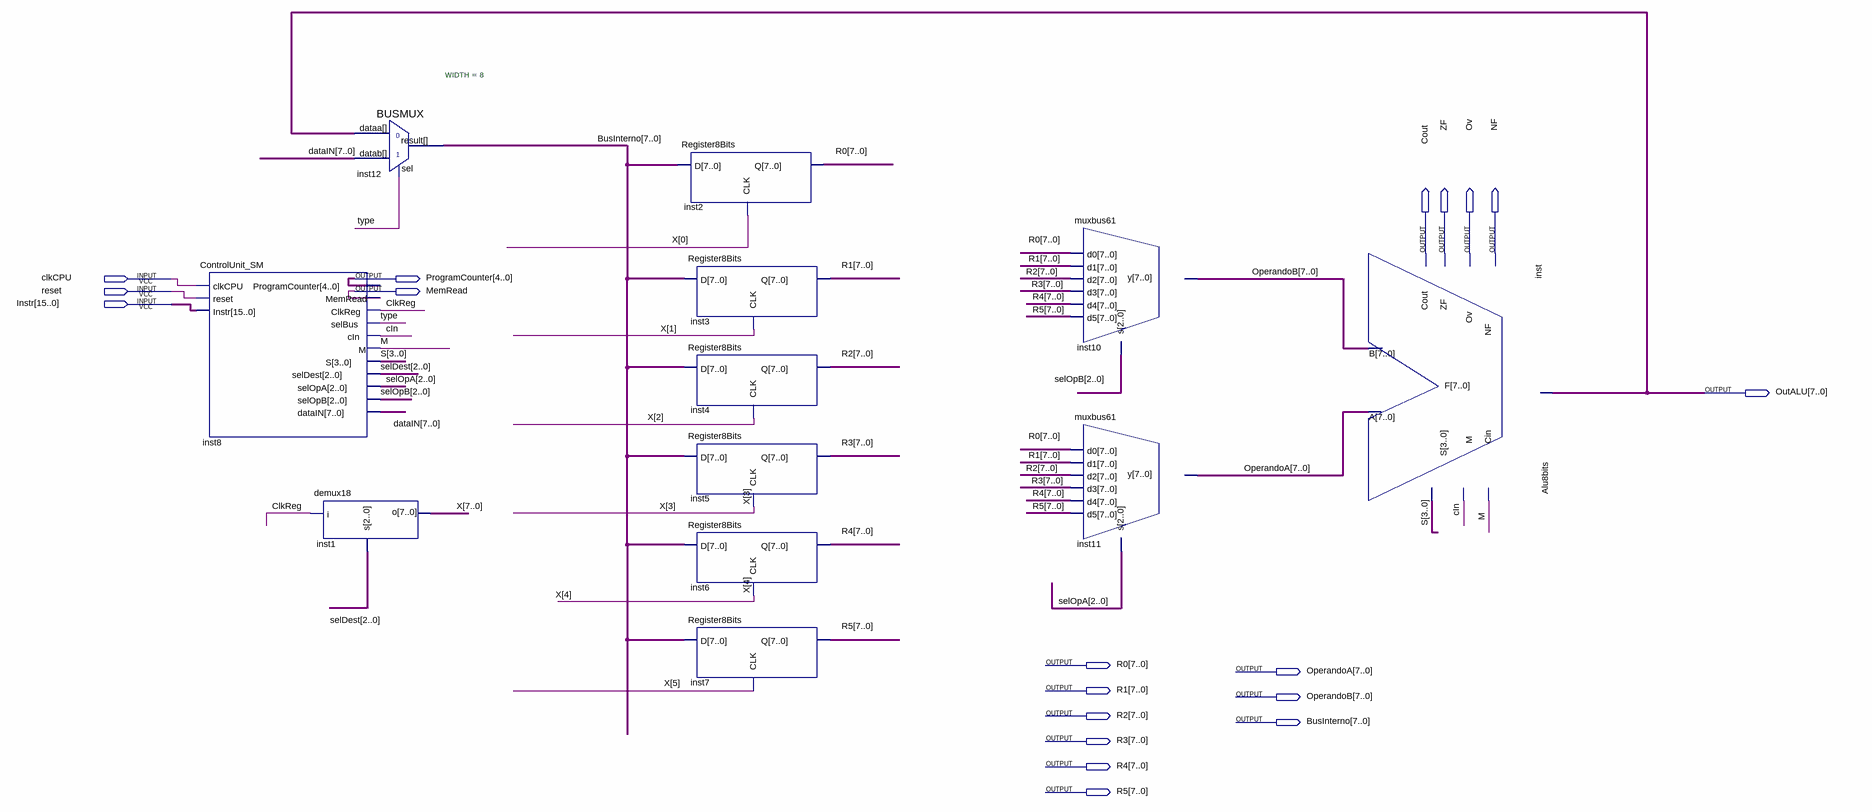
[diagram p0: schematic sheet]
// Quartus schematic CPU8bits_v2.bdf as structural Verilog: 12 symbols, 19 pins
module CPU8bits_v2 (
  input  clkCPU,
  input  reset,
  input  [15:0] Instr,
  output Cout,
  output ZF,
  output Ov,
  output NF,
  output [4:0] ProgramCounter,
  output MemRead,
  output [7:0] OutALU,
  output [7:0] R0,
  output [7:0] OperandoA,
  output [7:0] R1,
  output [7:0] OperandoB,
  output [7:0] R2,
  output [7:0] BusInterno,
  output [7:0] R3,
  output [7:0] R4,
  output [7:0] R5
);

  wire cIn, ClkReg, M, \type ;
  wire [2:0] selDest, selOpA, selOpB;
  wire [3:0] S;
  wire [7:0] dataIN, X;

  ControlUnit_SM inst8 (
    .clkCPU(clkCPU), .reset(reset), .Instr(Instr), .ProgramCounter(ProgramCounter), .MemRead(MemRead),
    .ClkReg(ClkReg), .selBus(\type ), .cIn(cIn), .M(M), .S(S), .selDest(selDest), .selOpA(selOpA),
    .selOpB(selOpB), .dataIN(dataIN));
  demux18 inst1 (.i(ClkReg), .s(selDest), .o(X));
  BUSMUX #(.WIDTH(8)) inst12 (.datab(dataIN), .sel(\type ), .dataa(OutALU), .result(BusInterno));
  Register8Bits inst2 (.D(BusInterno), .CLK(X[0]), .Q(R0));
  Register8Bits inst3 (.D(BusInterno), .CLK(X[1]), .Q(R1));
  Register8Bits inst4 (.D(BusInterno), .CLK(X[2]), .Q(R2));
  Register8Bits inst5 (.D(BusInterno), .CLK(X[3]), .Q(R3));
  Register8Bits inst6 (.D(BusInterno), .CLK(X[4]), .Q(R4));
  Register8Bits inst7 (.D(BusInterno), .CLK(X[5]), .Q(R5));
  muxbus61 inst10 (.s(selOpB), .d0(R0), .d1(R1), .d2(R2), .d3(R3), .d4(R4), .d5(R5), .y(OperandoB));
  muxbus61 inst11 (.s(selOpA), .d0(R0), .d1(R1), .d2(R2), .d3(R3), .d4(R4), .d5(R5), .y(OperandoA));
  Alu8bits inst (
    .A(OperandoA), .B(OperandoB), .S(S), .M(cIn), .Cin(M), .F(OutALU), .Cout(Cout), .ZF(ZF), .Ov(Ov), .NF(NF));
endmodule
